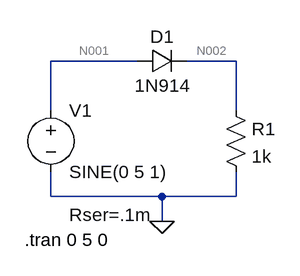
[diagram p0: schematic Diode Clipper.asc]
Diode Clipper.asc, the LTspice schematic file:
Version 4
SHEET 1 880 680
WIRE 160 96 48 96
WIRE 288 96 224 96
WIRE 48 160 48 96
WIRE 288 160 288 96
WIRE 48 272 48 240
WIRE 192 272 48 272
WIRE 288 272 288 240
WIRE 288 272 192 272
WIRE 192 304 192 272
FLAG 192 304 0
SYMBOL res 272 144 R0
SYMATTR InstName R1
SYMATTR Value 1k
SYMBOL voltage 48 144 R0
WINDOW 123 24 124 Left 2
WINDOW 39 24 152 Left 2
SYMATTR InstName V1
SYMATTR Value SINE(0 5 1)
SYMATTR SpiceLine Rser=.1m
SYMBOL diode 160 112 R270
WINDOW 0 32 32 VTop 2
WINDOW 3 0 32 VBottom 2
SYMATTR InstName D1
SYMATTR Value 1N914
TEXT 14 328 Left 2 !.tran 0 5 0

The netlist it stands for:
* Diode Clipper.asc
R1 N002 0 1k
V1 N001 0 SINE(0 5 1) Rser=.1m
D1 N001 N002 1N914
.model D D
.lib standard.dio
.tran 0 5 0
.backanno
.end

* Results of the author's LTspice run, read from the files saved beside the schematic
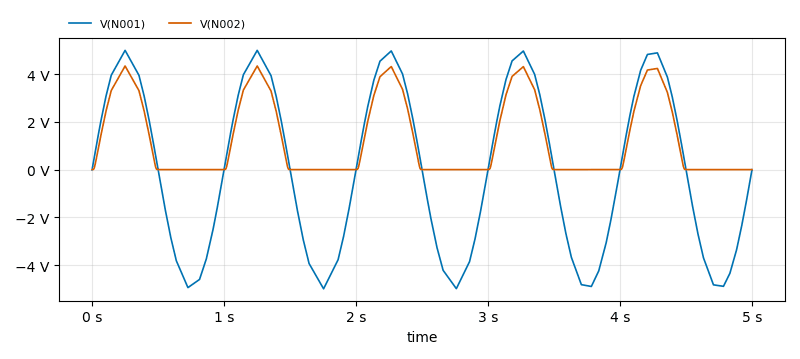
[diagram p1: Transient Analysis of Diode Clipper.asc, plotted from the saved traces]
* Transient Analysis, 1 run:
*   V(N001): min -4.992 V, max 4.994 V, average 323.1 µV, rms 3.481 V, last 0 V
*   V(N002): min -2.638 µV, max 4.34 V, average 1.265 V, rms 2.061 V, last 0 V